# EAGLE design battery_monitor_6803-2 -no_uno (EAGLE 6.3)
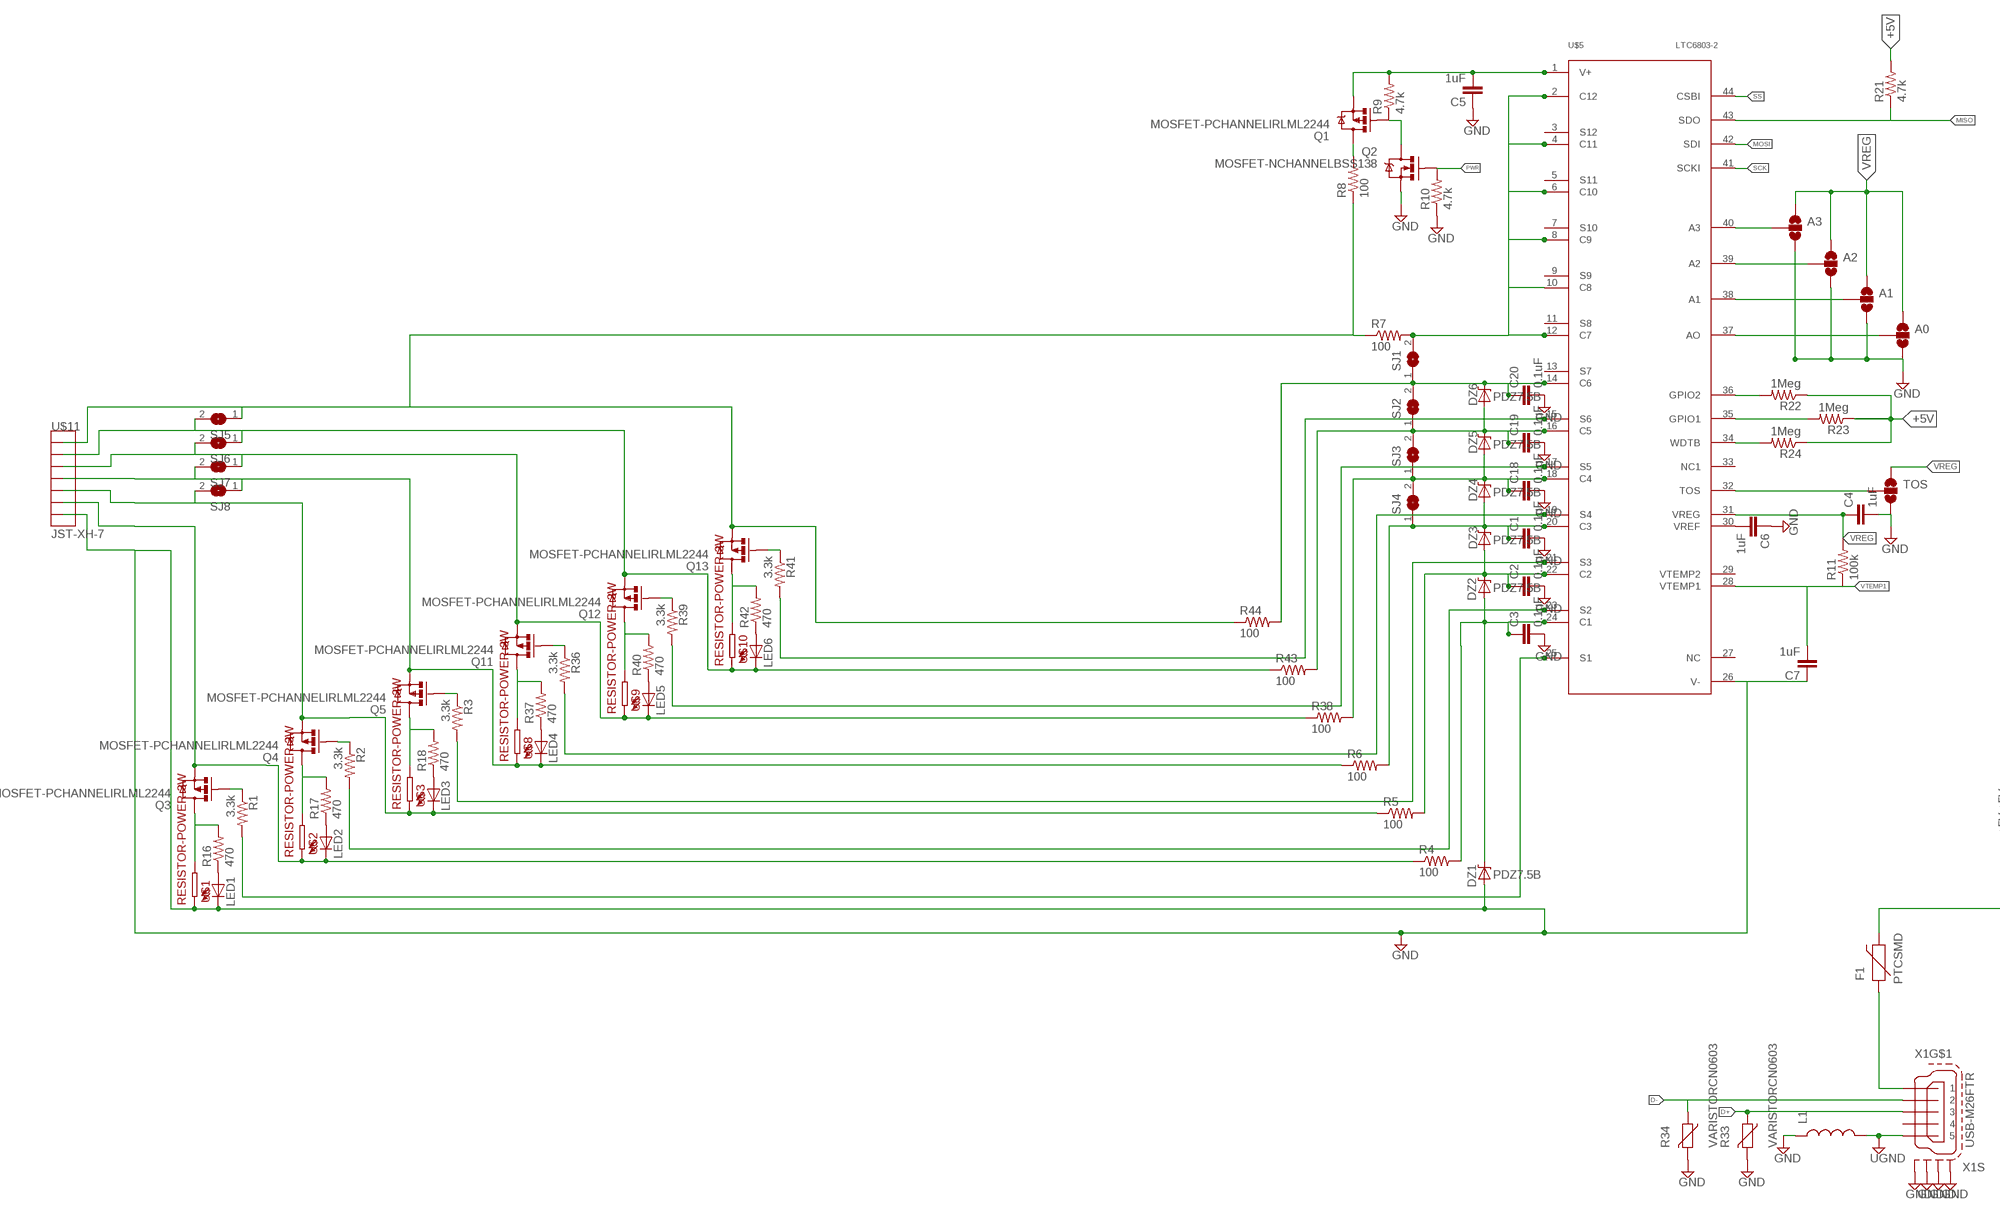
[diagram p0: schematic, sheet 1, part 1 of 2]
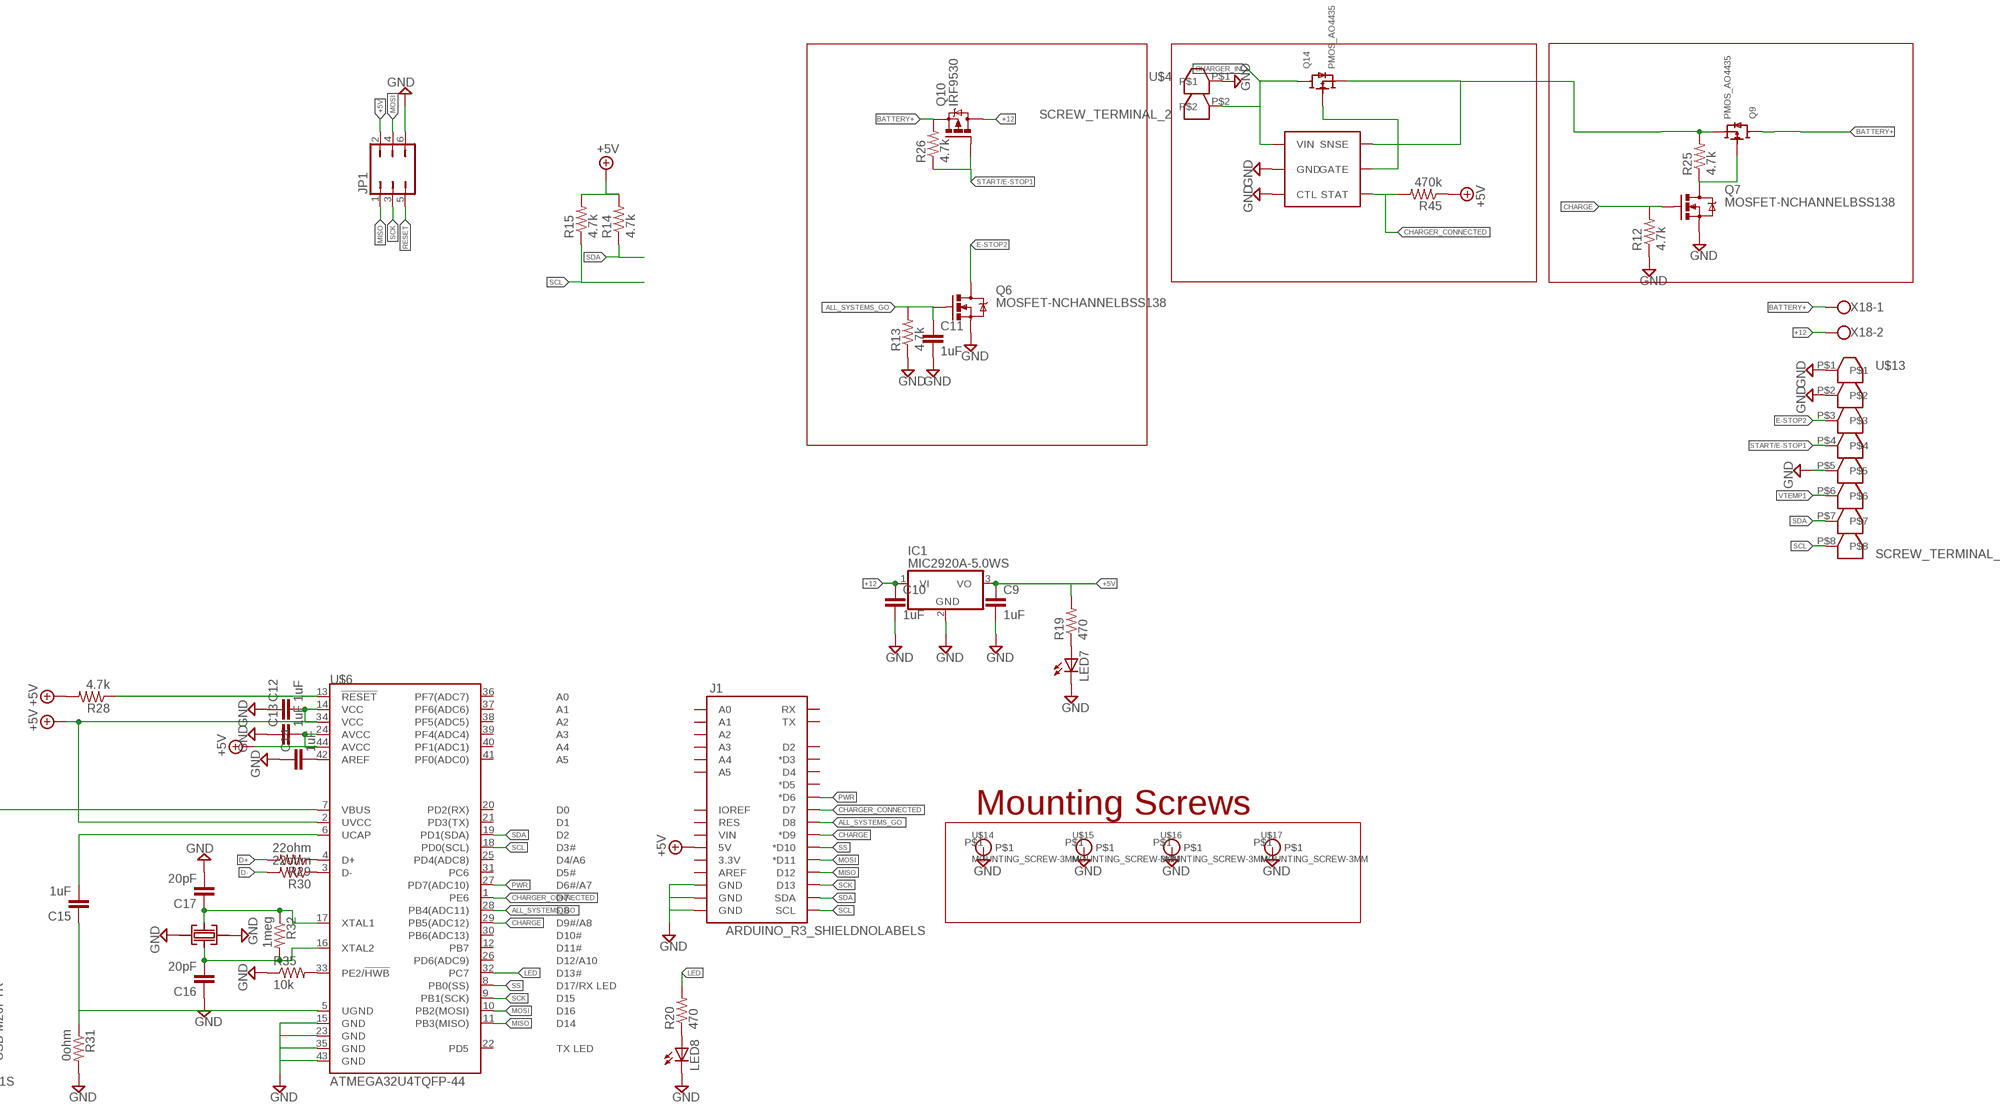
[diagram p1: schematic, sheet 1, part 2 of 2]

## Parts
A0  SOLDERJUMPER_2WAYS  [SJ_3]
A1  SOLDERJUMPER_2WAYS  [SJ_3]
A2  SOLDERJUMPER_2WAYS  [SJ_3]
A3  SOLDERJUMPER_2WAYS  [SJ_3]
C1  0.1uF  0.1UF-100V-10%(0603)  [0603-CAP]
C2  0.1uF  0.1UF-100V-10%(0603)  [0603-CAP]
C3  0.1uF  0.1UF-100V-10%(0603)  [0603-CAP]
C4  1uF  0.1UF-100V-10%(0603)  [0603-CAP]
C5  1uF  0.1UF-100V-10%(0603)  [0603-CAP]
C6  1uF  0.1UF-100V-10%(0603)  [0603-CAP]
C7  1uF  0.1UF-100V-10%(0603)  [0603-CAP]
C9  1uF  0.1UF-100V-10%(0603)  [0603-CAP]
C10  1uF  0.1UF-100V-10%(0603)  [0603-CAP]
C11  1uF  0.1UF-100V-10%(0603)  [0603-CAP]
C12  1uF  0.1UF-100V-10%(0603)  [0603-CAP]
C13  1uF  0.1UF-100V-10%(0603)  [0603-CAP]
C14  1uF  0.1UF-100V-10%(0603)  [0603-CAP]
C15  1uF  0.1UF-100V-10%(0603)  [0603-CAP]
C16  20pF  0.1UF-100V-10%(0603)  [0603-CAP]
C17  20pF  0.1UF-100V-10%(0603)  [0603-CAP]
C18  0.1uF  0.1UF-100V-10%(0603)  [0603-CAP]
C19  0.1uF  0.1UF-100V-10%(0603)  [0603-CAP]
C20  0.1uF  0.1UF-100V-10%(0603)  [0603-CAP]
DZ1  PDZ7.5B  DIODE-ZENER-BZT52  [SOD-323]
DZ2  PDZ7.5B  DIODE-ZENER-BZT52  [SOD-323]
DZ3  PDZ7.5B  DIODE-ZENER-BZT52  [SOD-323]
DZ4  PDZ7.5B  DIODE-ZENER-BZT52  [SOD-323]
DZ5  PDZ7.5B  DIODE-ZENER-BZT52  [SOD-323]
DZ6  PDZ7.5B  DIODE-ZENER-BZT52  [SOD-323]
F1  PTCSMD  [PTC-1206]
IC1  MIC2920A-5.0WS  MCP1703DB  [SOT223]
J1  ARDUINO_R3_SHIELDNOLABELS  [UNO_R3_SHIELD_NOLABELS]
JP1  JP3Q  [JP3Q]
L1  INDUCTOR0805  [0805]
LED1  LED0603  [LED-0603]
LED2  LED0603  [LED-0603]
LED3  LED0603  [LED-0603]
LED4  LED0603  [LED-0603]
LED5  LED0603  [LED-0603]
LED6  LED0603  [LED-0603]
LED7  LED0603  [LED-0603]
LED8  LED0603  [LED-0603]
Q1  MOSFET-PCHANNELIRLML2244  [SOT23-3]
Q2  MOSFET-NCHANNELBSS138  [SOT23]
Q3  MOSFET-PCHANNELIRLML2244  [SOT23-3]
Q4  MOSFET-PCHANNELIRLML2244  [SOT23-3]
Q5  MOSFET-PCHANNELIRLML2244  [SOT23-3]
Q6  MOSFET-NCHANNELBSS138  [SOT23]
Q7  MOSFET-NCHANNELBSS138  [SOT23]
Q9  PMOS_AO4435  [SOIC8]
Q10  IRF9530  [TO220BV]
Q11  MOSFET-PCHANNELIRLML2244  [SOT23-3]
Q12  MOSFET-PCHANNELIRLML2244  [SOT23-3]
Q13  MOSFET-PCHANNELIRLML2244  [SOT23-3]
Q14  PMOS_AO4435  [SOIC8]
R1  3.3k  3.3KOHM1/10W1%(0603)  [0603-RES]
R2  3.3k  3.3KOHM1/10W1%(0603)  [0603-RES]
R3  3.3k  3.3KOHM1/10W1%(0603)  [0603-RES]
R4  100  3.3KOHM1/10W1%(0603)  [0603-RES]
R5  100  3.3KOHM1/10W1%(0603)  [0603-RES]
R6  100  3.3KOHM1/10W1%(0603)  [0603-RES]
R7  100  3.3KOHM1/10W1%(0603)  [0603-RES]
R8  100  3.3KOHM1/10W1%(0603)  [0603-RES]
R9  4.7k  3.3KOHM1/10W1%(0603)  [0603-RES]
R10  4.7k  3.3KOHM1/10W1%(0603)  [0603-RES]
R11  100k  3.3KOHM1/10W1%(0603)  [0603-RES]
R12  4.7k  3.3KOHM1/10W1%(0603)  [0603-RES]
R13  4.7k  3.3KOHM1/10W1%(0603)  [0603-RES]
R14  4.7k  3.3KOHM1/10W1%(0603)  [0603-RES]
R15  4.7k  3.3KOHM1/10W1%(0603)  [0603-RES]
R16  470  3.3KOHM1/10W1%(0603)  [0603-RES]
R17  470  3.3KOHM1/10W1%(0603)  [0603-RES]
R18  470  3.3KOHM1/10W1%(0603)  [0603-RES]
R19  470  3.3KOHM1/10W1%(0603)  [0603-RES]
R20  470  3.3KOHM1/10W1%(0603)  [0603-RES]
R21  4.7k  3.3KOHM1/10W1%(0603)  [0603-RES]
R22  1Meg  3.3KOHM1/10W1%(0603)  [0603-RES]
R23  1Meg  3.3KOHM1/10W1%(0603)  [0603-RES]
R24  1Meg  3.3KOHM1/10W1%(0603)  [0603-RES]
R25  4.7k  3.3KOHM1/10W1%(0603)  [0603-RES]
R26  4.7k  3.3KOHM1/10W1%(0603)  [0603-RES]
R28  4.7k  3.3KOHM1/10W1%(0603)  [0603-RES]
R29  22ohm  3.3KOHM1/10W1%(0603)  [0603-RES]
R30  22ohm  3.3KOHM1/10W1%(0603)  [0603-RES]
R31  0ohm  3.3KOHM1/10W1%(0603)  [0603-RES]
R32  1meg  3.3KOHM1/10W1%(0603)  [0603-RES]
R33  VARISTORCN0603  [CT/CN0603]
R34  VARISTORCN0603  [CT/CN0603]
R35  10k  3.3KOHM1/10W1%(0603)  [0603-RES]
R36  3.3k  3.3KOHM1/10W1%(0603)  [0603-RES]
R37  470  3.3KOHM1/10W1%(0603)  [0603-RES]
R38  100  3.3KOHM1/10W1%(0603)  [0603-RES]
R39  3.3k  3.3KOHM1/10W1%(0603)  [0603-RES]
R40  470  3.3KOHM1/10W1%(0603)  [0603-RES]
R41  3.3k  3.3KOHM1/10W1%(0603)  [0603-RES]
R42  470  3.3KOHM1/10W1%(0603)  [0603-RES]
R43  100  3.3KOHM1/10W1%(0603)  [0603-RES]
R44  100  3.3KOHM1/10W1%(0603)  [0603-RES]
R45  470k  3.3KOHM1/10W1%(0603)  [0603-RES]
SJ1  SJ  [SJ]
SJ2  SJ  [SJ]
SJ3  SJ  [SJ]
SJ4  SJ  [SJ]
SJ5  SJ  [SJ]
SJ6  SJ  [SJ]
SJ7  SJ  [SJ]
SJ8  SJ  [SJ]
TOS  SOLDERJUMPER_2WAYS  [SJ_3]
U$1  RESISTOR-POWER-3W  [RESISTOR-3W]
U$2  RESISTOR-POWER-3W  [RESISTOR-3W]
U$3  RESISTOR-POWER-3W  [RESISTOR-3W]
U$4  SCREW_TERMINAL_2  [SCREW_TERMINAL_2]
U$5  LTC6803-2  [FSOP-44]
U$6  ATMEGA32U4TQFP-44  [TQFP44]
U$7  CRYSTAL_403  [CRYSTAL(DFN,LCC)]
U$8  RESISTOR-POWER-3W  [RESISTOR-3W]
U$9  RESISTOR-POWER-3W  [RESISTOR-3W]
U$10  RESISTOR-POWER-3W  [RESISTOR-3W]
U$11  JST-XH-7  [JST-XH-7]
U$12  LTC4412  [SOT-23-6]
U$13  SCREW_TERMINAL_8  [SCREW_TERMINAL_8]
U$14  MOUNTING_SCREW-3MM  [MOUNTING_SCREW-3MM]
U$15  MOUNTING_SCREW-3MM  [MOUNTING_SCREW-3MM]
U$16  MOUNTING_SCREW-3MM  [MOUNTING_SCREW-3MM]
U$17  MOUNTING_SCREW-3MM  [MOUNTING_SCREW-3MM]
X1  USB-M26FTR  MINI-USB-SCHIELD-32005-301  [32005-301]
X18  W237-102  [W237-102]

## Nets
+5V: C9.1 C12.2 C13.2 IC1.3(VO) J1.5V JP1.2 R14.2 R15.2 R19.2 R21.2 R22.1 R23.1 R24.1 R28.2 R45.1 U$6.2(UVCC) U$6.14(VCC) U$6.24(AVCC) U$6.34(VCC) U$6.44(AVCC)
+12: C10.1 IC1.1(VI) Q10.D X18.2
ALL_SYSTEMS_GO: C11.1 J1.D8 Q6.1(G) R13.2 U$6.28(PB4(ADC11))
BATTERY+: Q9.5(DRAIN) Q9.6(DRAIN) Q9.7(DRAIN) Q9.8(DRAIN) Q10.S R26.2 X18.1
CHARGE: J1.D9(*D9) Q7.1(G) R12.2 U$6.29(PB5(ADC12))
CHARGER_CONNECTED: J1.D7 R45.2 U$6.1(PE6) U$12.P$4(STAT)
CHARGER_IN: Q14.5(DRAIN) Q14.6(DRAIN) Q14.7(DRAIN) Q14.8(DRAIN) U$4.P$2 U$12.P$1(VIN)
D+: R29.2 R33.1 X1.3
D-: R30.2 R34.1 X1.2
E-STOP2: Q6.3(D) U$13.P$3
GND: A0.3 A1.3 A2.3 A3.3 C1.2 C2.2 C3.2 C4.2 C5.1 C6.1 C7.1 C9.2 C10.2 C11.2 C12.1 C13.1 C14.1 C16.1 C17.2 C18.2 C19.2 C20.2 DZ1.2(A) IC1.2(GND) J1.GND@0(GND) J1.GND@1(GND) J1.GND@2(GND) JP1.6 L1.1 LED1.C LED7.C LED8.C Q2.2(S) Q6.2(S) Q7.2(S) R10.1 R12.1 R13.1 R31.2 R33.2 R34.2 R35.1 TOS.3 U$1.P$2 U$4.P$1 U$5.26(V-) U$6.15(GND) U$6.23(GND) U$6.35(GND) U$6.43(GND) U$7.CASE U$7.CASE1 U$11.1 U$12.P$2(GND) U$12.P$3(CTL) U$13.P$1 U$13.P$2 U$13.P$5 U$14.P$1 U$15.P$1 U$16.P$1 U$17.P$1 X1.M1(S:S1) X1.M2(S:S2) X1.M3(S:S3) X1.M4(S:S4)
LED: R20.2 U$6.32(PC7)
MISO: J1.D12 JP1.1 R21.1 U$5.43(SDO) U$6.11(PB3(MISO))
MOSI: J1.D11(*D11) JP1.4 U$5.42(SDI) U$6.10(PB2(MOSI))
N$1: Q7.3(D) Q9.4(GATE) R25.1
N$2: LED2.C Q3.2(S) R4.1 U$2.P$2 U$11.2
N$3: LED3.C Q4.2(S) R5.1 SJ8.2 U$3.P$2 U$11.3
N$4: LED4.C Q5.2(S) R6.1 SJ7.2 SJ8.1 U$8.P$2 U$11.4
N$5: Q3.3(D) R16.2 U$1.P$1
N$6: R2.2 U$5.23(S2)
N$7: Q3.1(G) R1.1
N$8: R1.2 U$5.25(S1)
N$9: R3.2 U$5.21(S3)
N$10: Q4.3(D) R17.2 U$2.P$1
N$11: Q4.1(G) R2.1
N$12: Q5.3(D) R18.2 U$3.P$1
N$13: LED1.A R16.1
N$14: C1.1 DZ3.1(C) DZ4.2(A) R6.2 SJ4.1 U$5.20(C3)
N$15: C3.1 DZ1.1(C) DZ2.2(A) R4.2 U$5.24(C1)
N$16: C2.1 DZ2.1(C) DZ3.2(A) R5.2 U$5.22(C2)
N$17: R7.2 SJ1.2 U$5.2(C12) U$5.4(C11) U$5.6(C10) U$5.8(C9) U$5.10(C8) U$5.12(C7)
N$18: Q1.3(D) R8.2
N$19: C5.2 Q1.2(S) R9.2 U$5.1(V+)
N$20: Q1.1(G) Q2.3(D) R9.1
N$21: LED7.A R19.1
N$22: LED2.A R17.1
N$23: LED3.A R18.1
N$24: R22.2 U$5.36(GPIO2)
N$25: R23.2 U$5.35(GPIO1)
N$27: R24.2 U$5.34(WDTB)
N$28: A3.2 U$5.40(A3)
N$29: Q5.1(G) R3.1
N$30: A2.2 U$5.39(A2)
N$31: A1.2 U$5.38(A1)
N$32: A0.2 U$5.37(AO)
N$33: TOS.2 U$5.32(TOS)
N$34: C6.2 U$5.30(VREF)
N$35: LED8.A R20.1
N$36: C15.2 U$6.6(UCAP)
N$37: F1.1 X1.1
N$38: C14.2 U$6.42(AREF)
N$39: R35.2 U$6.33(PE2/!HWB)
N$40: R36.2 U$5.19(S4)
N$41: Q11.1(G) R36.1
N$42: Q11.3(D) R37.2 U$8.P$1
N$43: LED4.A R37.1
N$44: R29.1 U$6.4(D+)
N$45: R30.1 U$6.3(D-)
N$46: LED5.C Q11.2(S) R38.1 SJ6.2 SJ7.1 U$9.P$2 U$11.5
N$48: R39.2 U$5.17(S5)
N$49: Q12.1(G) R39.1
N$50: F1.2 U$6.7(VBUS)
N$51: C17.1 R32.1 U$6.17(XTAL1) U$7.IN
N$52: C16.2 R32.2 U$6.16(XTAL2) U$7.OUT
N$53: Q12.3(D) R40.2 U$9.P$1
N$54: LED5.A R40.1
N$55: C18.1 DZ4.1(C) DZ5.2(A) R38.2 SJ3.1 SJ4.2 U$5.18(C4)
N$56: LED6.C Q12.2(S) R43.1 SJ5.2 SJ6.1 U$10.P$2 U$11.6
N$58: R41.2 U$5.15(S6)
N$59: Q13.1(G) R41.1
N$60: Q9.1(SOURCE) Q9.2(SOURCE) Q9.3(SOURCE) Q14.1(SOURCE) Q14.2(SOURCE) Q14.3(SOURCE) R25.2 U$12.P$6(SNSE)
N$61: LED6.A R42.1
N$62: C19.1 DZ5.1(C) DZ6.2(A) R43.2 SJ2.1 SJ3.2 U$5.16(C5)
N$63: Q13.2(S) R7.1 R8.1 R44.1 SJ5.1 U$11.7
N$64: C20.1 DZ6.1(C) R44.2 SJ1.1 SJ2.2 U$5.14(C6)
N$67: Q14.4(GATE) U$12.P$5(GATE)
N$601: Q13.3(D) R42.2 U$10.P$1
PWR: J1.D6(*D6) Q2.1(G) R10.2 U$6.27(PD7(ADC10))
RESET: JP1.5 R28.1 U$6.13(!RESET)
SCK: J1.D13 JP1.3 U$5.41(SCKI) U$6.9(PB1(SCK))
SCL: J1.SCL R15.1 U$6.18(PD0(SCL)) U$13.P$8
SDA: J1.SDA R14.1 U$6.19(PD1(SDA)) U$13.P$7
SS: J1.D10(*D10) U$5.44(CSBI) U$6.8(PB0(SS))
START/E-STOP1: Q10.G R26.1 U$13.P$4
UGND: C15.1 L1.2 R31.1 U$6.5(UGND) X1.5
VREG: A0.1 A1.1 A2.1 A3.1 C4.1 R11.2 TOS.1 U$5.31(VREG)
VTEMP1: C7.2 R11.1 U$5.28(VTEMP1) U$13.P$6
Unconnected: J1.3.3V J1.A0 J1.A1 J1.A2 J1.A3 J1.A4 J1.A5 J1.AREF J1.D2 J1.D3(*D3) J1.D4 J1.D5(*D5) J1.IOREF J1.RES J1.RX J1.TX J1.VIN U$5.3(S12) U$5.5(S11) U$5.7(S10) U$5.9(S9) U$5.11(S8) U$5.13(S7) U$5.27(NC) U$5.29(VTEMP2) U$5.33(NC1) U$6.12(PB7) U$6.20(PD2(RX)) U$6.21(PD3(TX)) U$6.22(PD5) U$6.25(PD4(ADC8)) U$6.26(PD6(ADC9)) U$6.30(PB6(ADC13)) U$6.31(PC6) U$6.36(PF7(ADC7)) U$6.37(PF6(ADC6)) U$6.38(PF5(ADC5)) U$6.39(PF4(ADC4)) U$6.40(PF1(ADC1)) U$6.41(PF0(ADC0)) X1.4

## Notes on the sheet
- Mounting Screws

## Library data of the parts
A0 A1-A3 TOS = SparkFun:SOLDERJUMPER_2WAY: Solder Jumper 2 way solder jumper
C1-C3 C18-C20 = SparkFun-Capacitors:0.1UF-100V-10%(0603): CAP-08390; PROD_ID: CAP-08390
C4-C7 C9-C17 = SparkFun-Capacitors:0.1UF-100V-10%(0603): CAP-08390; PROD_ID: CAP-08390; VALUE: 0.1uF
DZ1-DZ6 = SparkFun-DiscreteSemi:DIODE-ZENER: Zener Diode Production Part - 8199 3.4V Zener Voltage
F1 = SparkFun-PowerIC:PTC: Resettable Fuse PTC Resettable Fuse. Spark Fun Electronics SKU : COM-08357; PROD_ID: RES-11150
IC1 = linear:MCP1703: 250 mA, 16V, Low Quiescent Current LDO Regulator Source: http://ww1.microchip.com/downloads/en/DeviceDoc/22049b.pdf
J1 = SparkFun-Boards:ARDUINO_R3_SHIELD: Shield form compatible with the Arduino Uno R3.
JP1 = jumper:JP3Q: JUMPER
L1 = SparkFun-Passives:INDUCTOR: Inductors Basic Inductor/Choke - 0603 and 1206. Footprints are not proven and vary greatly between part numbers. INDUCTOR POWER 3.3UH 4.0A SMD 0.197" L x 0.197" W x 0.177" H (5.00mm x 5.00mm x 4.50mm)
LED1-LED8 = SparkFun-LED:LED: LEDs Standard schematic elements and footprints for 5mm, 3mm, 1206, and 0603 sized LEDs. 5mm - Spark Fun Electronics SKU : COM-00529 (and others)
Q1 Q3-Q5 Q11-Q13 = SparkFun-DiscreteSemi:MOSFET-PCHANNEL: Generic PMOSFET; PROD_ID: TRANS-11153
Q2 Q6 Q7 = SparkFun-DiscreteSemi:MOSFET-NCHANNEL: Common NMOSFET Parts MFG P/N Store ID Prod ID FDD8780 TRANS-09984 SI7820DN TRANS-11055 FDS6630A IC-08089 2N7002PW TRANS-11151 FQP30N06L COM-10213 TRANS-10060 BSS123LT1G TRANS-08345 BSS138 TRANS-00830 BS170 2N7000; PROD_ID: TRANS-00830
Q9 Q14 = isaac1:PMOS_AO4435
Q10 = Adams Chips:IRF9530: P-CHANNEL HEXFET POWER-MOS-FET Source: http://www.irf.com/product-info/datasheets/data/irf9530.pdf
R1-R26 R28-R32 R35-R45 = SparkFun-Resistors:3.3KOHM1/10W1%(0603): RES-07851; PROD_ID: RES-07851
R33 R34 = varistor:VARISTOR: VARISTOR
SJ1-SJ8 = jumper:SJ: SMD solder JUMPER
U$1-U$3 U$8-U$10 = isaac1:RESISTOR-POWER-3W: PR03 series .205" dia x .657" L
U$4 = isaac1:SCREW_TERMINAL_2
U$5 = isaac1:LTC6803-2
U$6 = SparkFun-DigitalIC:ATMEGA32U4: Atmel 44-pin 8-bit Microcontroller with 32KBytes of ISP Flash and USB Controller
U$7 = isaac1:CRYSTAL_403
U$11 = isaac1:JST-XH-7
U$12 = isaac1:LTC4412
U$13 = isaac1:SCREW_TERMINAL_8
U$14-U$17 = isaac1:MOUNTING_SCREW-3MM
X1 = con-cypressindustries:MINI-USB-SCHIELD-: MINI USB-B Conector Source: www.cypressindustries.com; OC_FARNELL: unknown; OC_NEWARK: unknown
X18 = con-wago-500:W237-102: WAGO SCREW CLAMP; MPN: 237-102; OC_FARNELL: unknown; OC_NEWARK: 70K9898

## Board
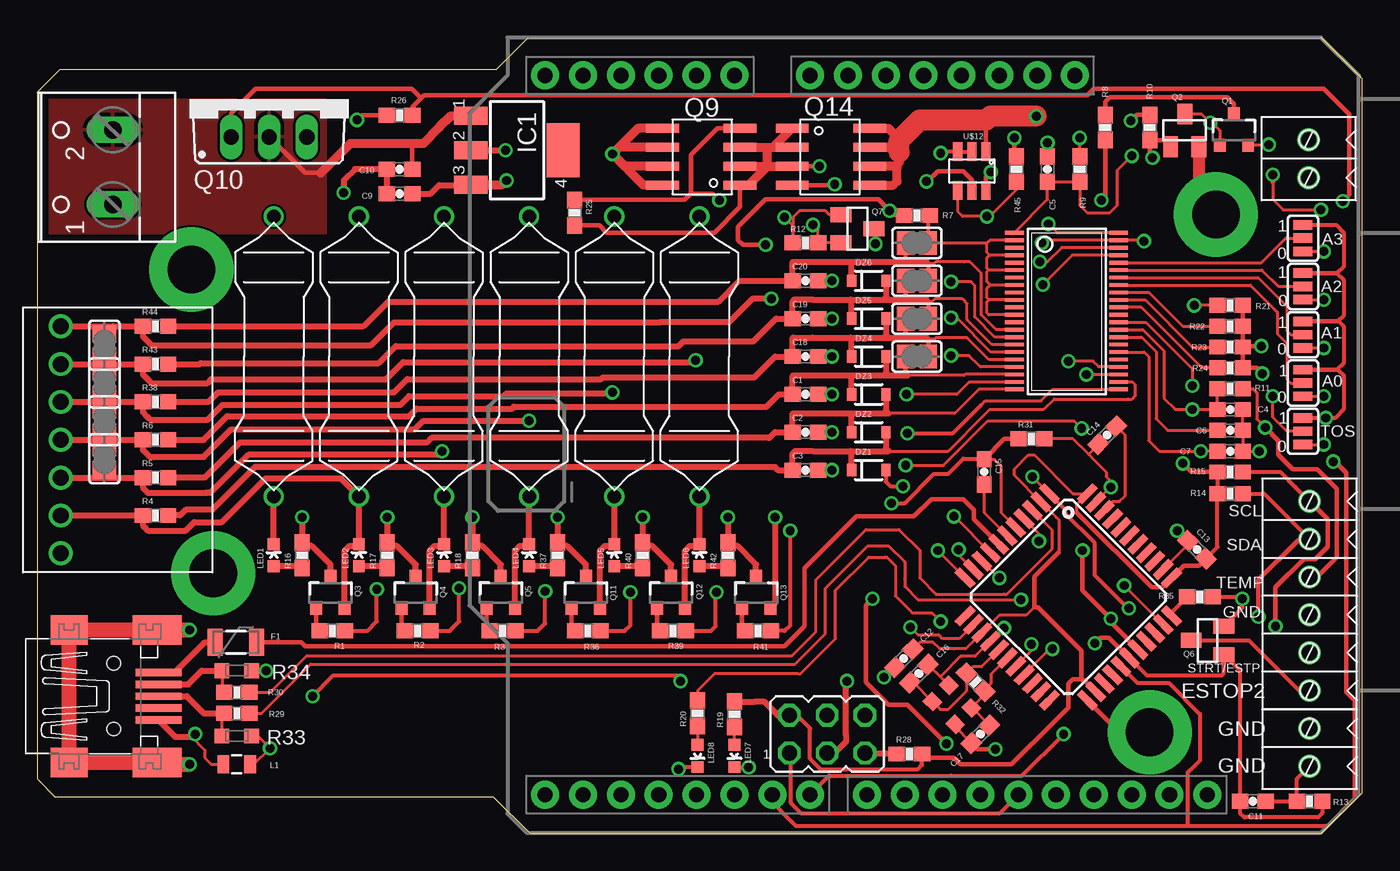
[diagram p2: board, top side]
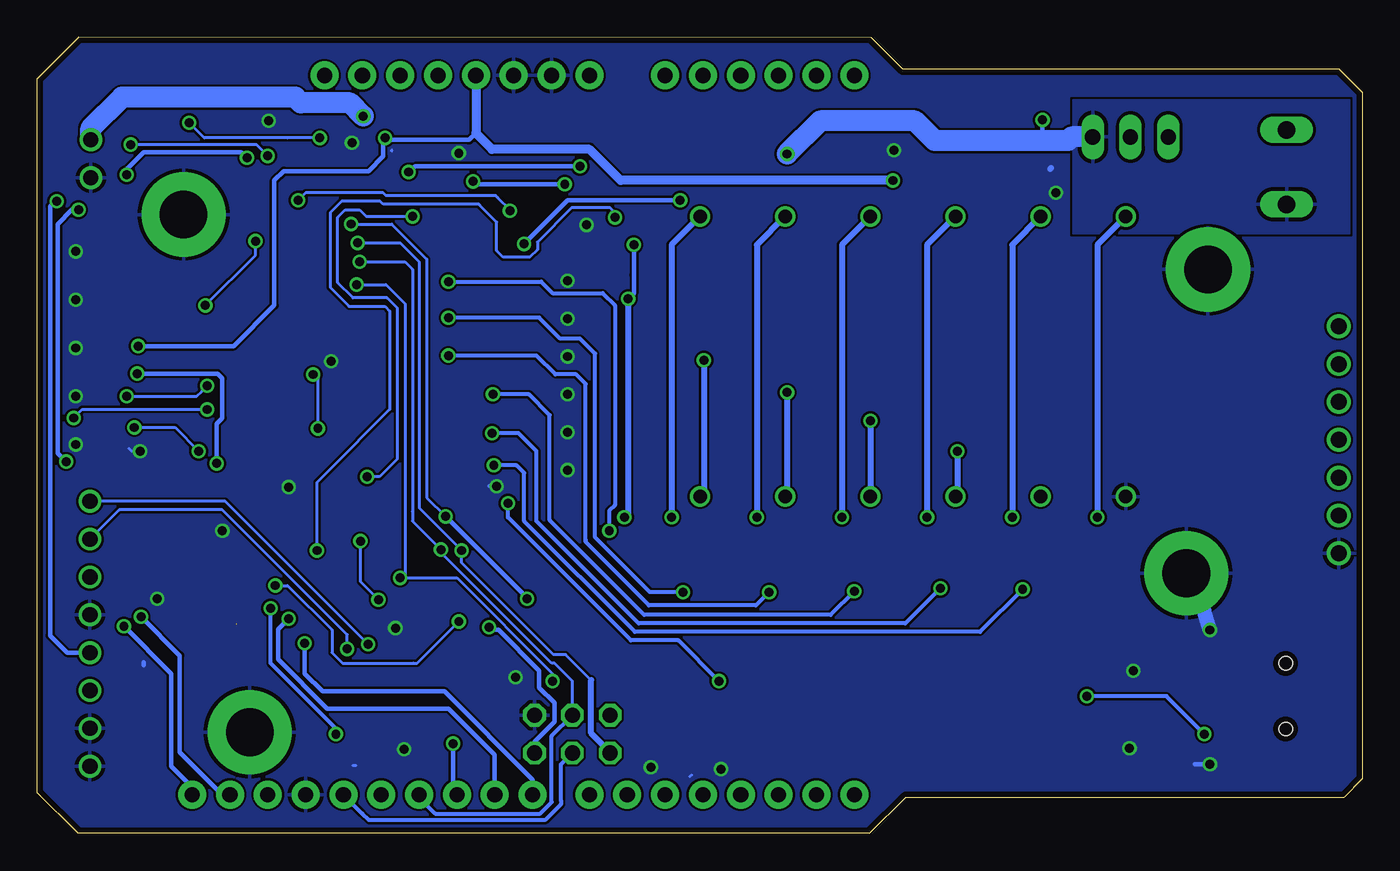
[diagram p3: board, bottom side, seen from below]

Size 88.94 x 53.43 mm. Coordinates in mm from the lower left corner, seen from the top.
Outline: 88.94,2.74 88.94,50.63
Outline: 88.94,50.63 86.15,53.43 32.95,53.4 30.82,51.27 1.56,51.3 0,49.74 0,49.73 0,3.66 1.22,2.44 30.63,2.44 33.07,0 86.2,0 86.2,0 88.94,2.74
Copper layers (1*16): Top 0.0356mm / dielectric 1.5011mm / Bottom 0.0356mm
Design rules "LaenPCBOrder *": minimum track width 6mil, minimum drill 13mil, track to track 6mil, track to pad 6mil, pad to pad 6mil, via to via 6mil, smd to smd 0mil, copper to edge 15mil, drill to drill 6mil, minimum pad ring 7mil, minimum via ring 7mil, stop-mask expansion 4mil, vias tented up to drill 25mil, thermal gap 10mil

### Footprints (pad centres in the part's own frame; a part is rotated, then mirrored left to right if it is on the bottom)
SJ_3 = smd 0.635 x 1.27: 1 -0.889,0; 2 0,0; 3 0.889,0
0603-CAP = smd 1.1 x 1: 1 -0.85,0; 2 0.85,0
SOD-323 = smd 0.63 x 0.83: 1 -1.15,0; 2 1.15,0
PTC-1206 = smd 1 x 1.8: 1 -1.4,0; 2 1.4,0
SOT223 = smd 1.219 x 2.235: 1 -2.311,-3.099; 2 0,-3.099; 3 2.311,-3.099 | smd 3.6 x 2.2: 4 0,3.099
UNO_R3_SHIELD_NOLABELS = drill 1.016 pad 1.88: 3.3V 50.8,26.67; 5V 50.8,29.21; A0 50.8,41.91; A1 50.8,44.45; A2 50.8,46.99; A3 50.8,49.53; A4 50.8,52.07; A5 50.8,54.61; AREF 2.54,15.24; D2 2.54,49.53; D3 2.54,46.99; D4 2.54,44.45; D5 2.54,41.91; D6 2.54,39.37; D7 2.54,36.83; D8 2.54,33.02; D9 2.54,30.48; D10 2.54,27.94; D11 2.54,25.4; D12 2.54,22.86; D13 2.54,20.32; GND@0 50.8,31.75; GND@1 50.8,34.29; GND@2 2.54,17.78; IOREF 50.8,21.59; NC 50.8,19.05; RES 50.8,24.13; RX 2.54,54.61; SCL 2.54,10.16; SDA 2.54,12.7; TX 2.54,52.07; VIN 50.8,36.83
JP3Q = drill 1.016 pad 1.346 octagon: 1 -2.54,-1.27; 2 -2.54,1.27; 3 0,-1.27; 4 0,1.27; 5 2.54,-1.27; 6 2.54,1.27
0805 = smd 0.8 x 1.2: 1 -0.9,0; 2 0.9,0
LED-0603 = smd 0.8 x 0.8: A 0,-0.75; C 0,0.75
SOT23-3 = smd 0.8 x 0.9: 1 -0.95,-1; 2 0.95,-1; 3 0,1.1
SOT23 = smd 1 x 1.4: 1 -0.95,-1.1; 2 0.95,-1.1; 3 0,1.1
SOIC8 = smd 0.6 x 2.2: 1 -1.905,-2.54; 2 -0.635,-2.54; 3 0.635,-2.54; 4 1.905,-2.54; 5 1.905,2.66; 6 0.635,2.66; 7 -0.635,2.66; 8 -1.905,2.66
TO220BV = drill 1.016 long: D 0,-2.54; G -2.54,-2.54; S 2.54,-2.54
0603-RES = smd 1.1 x 1: 1 -0.85,0; 2 0.85,0
CT/CN0603 = smd 1 x 1: 1 -1,0; 2 1,0
SJ = smd 1.168 x 1.6: 1 -0.762,0; 2 0.762,0
RESISTOR-3W = drill 0.9: P$1 0,9.398; P$2 0,-9.398
SCREW_TERMINAL_2 = drill 1.016 pad 1.422: P$1 0,1.27; P$2 0,-1.27
FSOP-44 = smd 0.25 x 1.25: 1 -5.25,-3.5; 2 -4.75,-3.5; 3 -4.25,-3.5; 4 -3.75,-3.5; 5 -3.25,-3.5; 6 -2.75,-3.5; 7 -2.25,-3.5; 8 -1.75,-3.5; 9 -1.25,-3.5; 10 -0.75,-3.5; 11 -0.25,-3.5; 12 0.25,-3.5; 13 0.75,-3.5; 14 1.25,-3.5; 15 1.75,-3.5; 16 2.25,-3.5; 17 2.75,-3.5; 18 3.25,-3.5; 19 3.75,-3.5; 20 4.25,-3.5; 21 4.75,-3.5; 22 5.25,-3.5; 23 5.25,3.5; 24 4.75,3.5; 25 4.25,3.5; 26 3.75,3.5; 27 3.25,3.5; 28 2.75,3.5; 29 2.25,3.5; 30 1.75,3.5; 31 1.25,3.5; 32 0.75,3.5; 33 0.25,3.5; 34 -0.25,3.5; 35 -0.75,3.5; 36 -1.25,3.5; 37 -1.75,3.5; 38 -2.25,3.5; 39 -2.75,3.5; 40 -3.25,3.5; 41 -3.75,3.5; 42 -4.25,3.5; 43 -4.75,3.5; 44 -5.25,3.5
TQFP44 = smd 1.5 x 0.5: 1 -5.8,4; 2 -5.8,3.2; 3 -5.8,2.4; 4 -5.8,1.6; 5 -5.8,0.8; 6 -5.8,0; 7 -5.8,-0.8; 8 -5.8,-1.6; 9 -5.8,-2.4; 10 -5.8,-3.2; 11 -5.8,-4; 23 5.8,-4; 24 5.8,-3.2; 25 5.8,-2.4; 26 5.8,-1.6; 27 5.8,-0.8; 28 5.8,0; 29 5.8,0.8; 30 5.8,1.6; 31 5.8,2.4; 32 5.8,3.2; 33 5.8,4 | smd 0.5 x 1.5: 12 -4,-5.8; 13 -3.2,-5.8; 14 -2.4,-5.8; 15 -1.6,-5.8; 16 -0.8,-5.8; 17 0,-5.8; 18 0.8,-5.8; 19 1.6,-5.8; 20 2.4,-5.8; 21 3.2,-5.8; 22 4,-5.8; 34 4,5.8; 35 3.2,5.8; 36 2.4,5.8; 37 1.6,5.8; 38 0.8,5.8; 39 0,5.8; 40 -0.8,5.8; 41 -1.6,5.8; 42 -2.4,5.8; 43 -3.2,5.8; 44 -4,5.8
CRYSTAL(DFN,LCC) = smd 0.991 x 0.889: CASE 1.079,-0.775; CASE1 -1.079,0.775; IN -1.079,-0.775; OUT 1.079,0.775
JST-XH-7 = drill 1.067: 1 0,-7.62; 2 0,-5.08; 3 0,-2.54; 4 0,0; 5 0,2.54; 6 0,5.08; 7 0,7.62
SOT-23-6 = smd 0.62 x 1.22: P$1 -0.95,-1.31; P$2 0,-1.31; P$3 0.95,-1.31; P$4 0.95,1.31; P$5 0,1.31; P$6 -0.95,1.31
SCREW_TERMINAL_8 = drill 1.016 pad 1.422: P$1 0,8.89; P$2 0,6.35; P$3 0,3.81; P$4 0,1.27; P$5 0,-1.27; P$6 0,-3.81; P$7 0,-6.35; P$8 0,-8.89
MOUNTING_SCREW-3MM = drill 3.2 pad 5.65: P$1 0,0
32005-301 = smd 3.1 x 0.5: 1 3,1.6; 2 3,0.8; 3 3,0; 4 3,-0.8; 5 3,-1.6 | smd 2.5 x 2: M1 -3,-4.45; M2 -3,4.45 | smd 3.3 x 2: M3 2.9,4.45; M4 2.9,-4.45 | hole 0.9: 0,2.2; 0,-2.2
W237-102 = drill 1.194 long: 1 -2.5,-1.27; 2 2.5,-1.27

### Placement (x,y rotation side)
A0  84.96,30.23 270 top
A1  84.96,33.46 270 top
A2  84.96,36.7 270 top
A3  84.96,39.94 270 top
C1  51.56,29.46 0 top
C2  51.56,26.92 0 top
C3  51.56,24.38 0 top
C4  80.07,28.45 0 top
C5  67.82,44.58 270 top
C6  80.07,27.05 180 top
C7  80.07,25.65 180 top
C9  24.32,42.93 180 top
C10  24.32,44.58 180 top
C11  81.6,2.16 0 top
C12  58.17,11.75 45 top
C13  77.85,19.05 315 top
C14  71.82,26.73 45 top
C15  63.56,24.26 270 top
C16  59.18,10.73 225 top
C17  63.31,6.67 225 top
C18  51.56,32 0 top
C19  51.56,34.54 0 top
C20  51.56,37.08 0 top
DZ1  55.82,24.38 0 top
DZ2  55.82,26.92 0 top
DZ3  55.82,29.46 0 top
DZ4  55.82,32 0 top
DZ5  55.82,34.54 0 top
DZ6  55.82,37.08 0 top
F1  13.34,12.83 0 top
IC1  32.19,45.85 270 top
J1  88.71,0.06 90 top
JP1  53.02,6.67 0 top
L1  13.4,4.64 180 top
LED1  15.88,18.67 0 top
LED2  21.59,18.67 0 top
LED3  27.3,18.67 0 top
LED4  33.02,18.67 0 top
LED5  38.73,18.67 0 top
LED6  44.45,18.67 0 top
LED7  46.8,5.21 180 top
LED8  44.32,5.21 180 top
Q1  80.33,47.18 0 top
Q2  77.03,47.18 0 top
Q3  19.68,16.13 0 top
Q4  25.4,16.13 0 top
Q5  31.11,16.13 0 top
Q6  78.55,12.95 90 top
Q7  55.05,40.58 270 top
Q9  44.64,45.4 90 top
Q10  15.56,49.28 0 top
Q11  36.83,16.13 0 top
Q12  42.55,16.13 0 top
Q13  48.26,16.13 0 top
Q14  53.21,45.4 270 top
R1  19.81,13.59 0 top
R2  25.53,13.59 0 top
R3  31.24,13.59 0 top
R4  7.94,21.34 0 top
R5  7.94,23.88 0 top
R6  7.94,26.42 0 top
R7  59.05,41.47 0 top
R8  71.69,47.37 90 top
R9  69.98,44.58 270 top
R10  74.68,47.37 270 top
R11  80.07,29.84 180 top
R12  51.56,39.62 180 top
R13  85.41,2.16 0 top
R14  80.07,22.8 180 top
R15  80.07,24.26 180 top
R16  17.78,18.67 90 top
R17  23.5,18.67 90 top
R18  29.21,18.67 90 top
R19  46.8,8 90 top
R20  44.32,8.06 90 top
R21  80.07,35.43 0 top
R22  80.07,34.04 180 top
R23  80.07,32.64 180 top
R24  80.07,31.24 180 top
R25  36.07,41.66 270 top
R26  24.32,48.2 180 top
R28  58.55,5.33 0 top
R29  13.4,8.06 180 top
R30  13.4,9.46 180 top
R31  66.74,26.48 0 top
R32  62.99,10.16 135 top
R33  13.4,6.54 0 top
R34  13.4,10.92 0 top
R35  78.04,15.88 180 top
R36  36.96,13.59 0 top
R37  34.92,18.67 90 top
R38  7.94,28.96 0 top
R39  42.67,13.59 0 top
R40  40.64,18.67 90 top
R41  48.39,13.59 0 top
R42  46.35,18.67 90 top
R43  7.94,31.5 0 top
R44  7.94,34.04 0 top
R45  65.72,44.58 270 top
SJ1  59.05,39.62 0 top
SJ2  59.05,37.08 0 top
SJ3  59.05,34.54 0 top
SJ4  59.05,32 0 top
SJ5  4.51,32.77 270 top
SJ6  4.51,30.23 270 top
SJ7  4.51,27.69 270 top
SJ8  4.51,25.15 270 top
TOS  84.96,26.99 270 top
U$1  15.88,32 0 top
U$2  21.59,32 0 top
U$3  27.3,32 0 top
U$4  85.34,45.28 180 top
U$5  69.09,35.05 270 top
U$6  69.22,15.88 315 top
U$7  61.4,8.64 135 top
U$8  33.02,32 0 top
U$9  38.73,32 0 top
U$10  44.45,32 0 top
U$11  1.59,26.42 0 top
U$12  62.74,44.45 180 top
U$13  85.41,13.4 180 top
U$14  11.81,17.46 0 top
U$15  74.68,6.79 0 top
U$16  10.35,37.85 0 top
U$17  79.12,41.53 0 top
X1  5.14,9.21 0 top
X18  3.81,44.7 90 top

### Tracks (layer width: path | path; a pad name or v marks a point on that pad's centre or on a via)
+5V  (via drill 0.6)
  Top 0.203: C12.2 59.24,12.83 60.13,12.83 60.58,12.38 61.53,12.38 62.33,12.38 U$6.14 64.61,14.67 65.34,14.67 66.42,14.67 66.93,15.18 | C13.2 | 69.79,21.53 69.79,22.1 U$6.44 69.52,22.8 66.93,25.4 66.55,25.4 65.6,24.45 65.6,24.02 U$6.2 68.41,21.21 68.58,21.04 68.58,18.86 | 70.28,10.29 70.17,10.29 | R23.1 80.99,32.7
  Top 0.254: R15.2 R14.2 79.22,19.22 C13.2 | 59.37,5.31 R28.2 59.4,4.6 59.12,4.32 52.58,4.32 51.88,5.02 51.88,7.05 50.99,7.94 JP1.2
  Top 0.305: C13.2 77.98,17.97 76.97,17.97 U$6.34 75.51,16.51 74.8,16.51 69.79,21.53 | U$6.24 70.28,10.29 | 68.58,18.86 66.93,17.21 66.93,15.18 67.18,15.18 70.1,12.26 70.1,10.35 | 70.1,10.35 70.17,10.29 | v65.6,46.67 65.6,45.55 R45.1 | R21.2 R22.1 R23.1 R24.1 81.85,31.24 v82.23,30.86 | 80.99,32.7 v82.17,32.7 | 29.06,43.5 IC1.3 | 70.1,10.35 69.53,10.35 69.22,10.03 69.22,8.45 68.26,7.49 65.41,4.64 62.99,4.64 61.98,4.64 61.53,5.08 59.65,5.08 R28.2 | R15.2 77.47,24.26 v76.9,24.83
  Top 0.406: IC1.3 29.06,43.5 26.99,43.5 26.42,42.93 C9.1 | R19.2 46.82,8.83 48.13,8.83 48.83,8.83 49.66,8 49.66,7.94 JP1.2
  Top 0.61: IC1.3 31.22,43.54 v31.5,43.81
  Bottom 0.203: 65.72,46.55 v65.6,46.67
  Bottom 0.305: v65.6,46.67 65.47,46.55 60.01,46.55 59.94,46.55 59.5,46.99 | 65.72,46.55 R45.1 66.7,44.45 72.39,44.45 73.03,43.81 73.03,35.43 75.75,32.7 v82.17,32.7 | v76.9,24.83 76.9,27.5 76.52,27.88 76.52,30.54 76.83,30.86 v82.23,30.86
  Bottom 0.61: v31.5,43.81 49.78,43.81 51.88,45.91 58.42,45.91 59.5,46.99 J1.5V
+12
  Top 0.305: 29.07,48.13 IC1.1 | 19.05,44.32 17.97,44.32 Q10.D | C10.1 25.17,46.19 25.27,46.29
  Top 0.61: 29.07,48.13 27.75,48.13 26.99,47.37 25.91,46.29 25.27,46.29 21.02,46.29 19.05,44.32
  pour Top: 0.83,40.32 19.37,40.32 19.37,49.21 0.83,49.21
ALL_SYSTEMS_GO  (via drill 0.6)
  Top 0.254: R13.2 86.26,1.36 85.98,1.08 81.03,1.08 80.77,1.33 80.77,2.13 C11.1 80.75,10.91 Q6.1 79.65,10.75 79.5,10.6 74.48,10.6 U$6.28
  Top 0.305: v70.99,12.76 71.37,13.14 71.82,13.14 71.94,13.14 U$6.28
  Bottom 0.305: v70.99,12.76 70.99,10.73 69.79,9.53 62.61,9.53 61.59,9.53 55.69,3.62 J1.D8
BATTERY+  (via drill 0.6)
  Top 0.305: R26.2 22.61,48.2 21.78,48.2 v21.46,47.88
  Top 0.61: Q9.5 40.32,47.31 v38.61,45.59 | Q9.6 39.05,46.04 v38.61,45.59 | Q9.7 39.43,44.77 v38.61,45.59 | Q9.8 40.7,43.5 v38.61,45.59
  Bottom 0.203: Q10.S 19.62,46.74 | 20.89,46.48 20.7,46.48
  Bottom 0.305: 21.46,46.99 v21.46,47.88 21.46,46.99 | 21.46,46.99 21.46,46.48
  Bottom 1.422: Q10.S 19.49,46.74 19.75,46.48 20.7,46.48 20.89,46.48 21.46,46.48 22.35,46.48 28.7,46.48 30.04,47.82 36.39,47.82 v38.61,45.59
  pour Bottom (isolate 0.203): 0.89,40.26 19.37,40.26 19.37,49.21 0.89,49.21
CHARGE  (via drill 0.6)
  Top 0.203: Q7.1 53.15,41.53 52.9,41.78 51.18,41.78 50.74,41.34 50.74,39.75 | 50.74,39.75 50.74,39.65 R12.2 | 50.74,39.75 50.74,40.77 v50.16,41.34 | U$6.29 73.88,12.35
  Top 0.305: U$6.29 72.33,13.89 72.07,14.15 v72.07,14.41 70.17,16.32 70.17,16.7 v70.17,18.99
  Bottom 0.203: v50.16,41.34 50.16,41.66 50.48,41.97 53.09,41.97 55.37,39.69 55.37,39.18 55.88,38.67 57.66,38.67 58.1,39.12 58.1,41.02 59.24,42.16 59.31,42.23 65.72,42.23 65.91,42.42 68.52,42.42 69.28,41.66 69.28,36.64 68.01,35.37 65.6,35.37 65.28,35.05 65.28,28.45 69.53,24.19 70.17,23.56 v70.17,18.99
  Bottom 0.305: J1.D9 58.23,5.27 61.34,8.38 69.47,8.38 72.77,11.68 72.77,13.72 v72.07,14.41
CHARGER_CONNECTED  (via drill 0.6)
  Top 0.203: U$6.1 v66.8,23.94 | R45.2 65.72,43.18 63.94,41.4 v63.75,41.4 62.1,41.4 61.78,41.72 U$12.P$4 | U$12.P$4
  Top 0.254: J1.D7 53.15,3.87 61.34,3.87 66.1,3.87 v68.9,6.67 | v73.28,15.11 73.22,15.11 70.99,17.34 70.99,19.49 69.03,21.46 69.03,21.72 U$6.1
  Bottom 0.203: v63.75,41.4 66.86,41.4 67.31,41.85 68.26,41.85 68.77,41.34 68.77,36.96 67.75,35.94 65.47,35.94 64.77,35.24 64.77,25.15 65.98,23.94 v66.8,23.94
  Bottom 0.254: v68.9,6.67 68.9,7.05 73.28,11.43 v73.28,15.11
CHARGER_IN  (via drill 0.6)
  Top 0.305: 57.47,43.5 57.72,43.75 | 57.72,46.74 57.72,43.88 57.78,43.81 | U$12.P$1 63.69,47.88
  Top 0.61: Q14.8 57.15,47.31 57.72,46.74 57.72,46.23 57.53,46.04 | 57.53,46.04 Q14.7 57.53,46.04 | 57.53,46.04 57.85,45.72 57.85,45.02 57.59,44.77 | 57.59,44.77 Q14.6 | Q14.5 57.47,43.5 | 57.72,43.75 57.72,44.64 57.59,44.77
  Top 1.422: 57.85,45.72 57.85,46.48 59.24,47.88 63.69,47.88 64.01,48.13 v67.06,48.13
  Bottom 1.422: U$4.P$2 85.34,47.31 83.25,49.4 72.52,49.4 71.63,49.4 71.25,49.02 67.94,49.02 v67.06,48.13
D+
  Top 0.203: R33.1 12.4,7.92 R29.2
  Top 0.406: X1.3 10.03,9.21 11.18,8.06 R29.2
D-
  Top 0.203: R34.1 12.4,9.61 R30.2
  Top 0.406: X1.2 10.13,10.01 11.05,10.92 R34.1
E-STOP2
  Top 0.254: Q6.3 81.34,12.95 84.71,9.59 U$13.P$3
GND  (via drill 0.6)
  Top 0.203: U$5.26 71.25,31.3 70.87,31.69 v69.22,31.69 | C4.2 C6.1 C7.1 v82.04,25.65 | A3.3 v86.36,39.05 | A2.3 v86.36,35.81 | A1.3 v86.36,32.58 | A0.3 v86.36,29.34 | TOS.3 v86.36,26.1 | U$7.CASE 60.62,10.52 | 60.62,10.52 59.8,11.33 C16.1 | 60.62,10.52 61.98,11.87 62.95,11.87 U$6.15 64.86,13.78 v64.9,13.78 | C17.2 61.62,7.16 U$7.CASE1 | C12.1 57.5,11.15 v56.83,10.48 | U$6.35 77.25,19.38 C13.1 76.58,20.32 v76.52,20.32 | U$6.43 71.86,23.05 v72.07,23.24 72.07,23.62 71.75,23.94 71.75,24.25 70.99,25.02 70.58,25.43 | R34.2 v15.37,10.92 | R33.2 14.8,6.54 v15.62,5.71 14.54,4.64 L1.1 | Q7.2 R12.1 52.41,40.49 v52.07,40.83 | C5.1 v67.82,46.35 | 70.58,25.43 69.53,26.48 R31.2 | C14.1 71.22,26.07 70.58,25.43
  Top 0.254: DZ1.2 56.97,23.61 57.28,23.3 v58.1,23.3 | U$12.P$2 U$12.P$3 60.75,45.76 v60.64,45.66 | LED8.C 43.19,4.46 v43.05,4.32 | LED7.C v47.74,4.46 v47.75,4.45 | C11.2 R13.1 84.56,3.66 U$13.P$1 | R35.1 80.77,15.88 v80.9,15.75 80.9,15.15 Q6.2
  Top 0.305: X1.M4 8.16,4.64 | R10.1 73.81,48.22 v73.41,47.82 | U$6.23 72.64,6.79 73.28,6.79 U$15.P$1 | C17.2 63.12,5.65 v64.33,5.65
  Top 0.406: LED1.C U$1.P$2 | C20.2 v53.34,37.08 | C19.2 v53.34,34.54 | C18.2 v53.34,32 | C1.2 v53.34,29.46 | C2.2 v53.34,26.92 | C3.2 v53.34,24.38 | IC1.2 v31.43,45.85 | C9.2 C10.2 21.34,44.58 20.57,43.81 v20.57,42.99
  Top 0.813: Q2.2 77.97,42.67 U$17.P$1
  Top 1.016: X1.M4 X1.M1 X1.M2 X1.M3 8.96,13.66 v10.22,13.65 | 8.16,4.64 v10.22,4.64
  Bottom 0.203: v69.22,31.69 69.22,31.62 | v82.04,25.65 82.61,25.65 82.8,25.84 | v86.36,39.05 86.55,39.05 | v86.36,35.81 86.42,35.81 | v86.36,32.58 86.36,32.83 | v86.36,29.34 86.36,29.59 | v86.36,26.1 86.36,26.23 | v64.9,13.78 64.96,13.84 | v56.83,10.48 56.83,10.41 | v72.07,23.24 72.14,23.3 | v76.52,20.32 76.45,20.32 | v15.37,10.92 15.49,10.92 | v15.62,5.71 15.81,5.71 | 67.75,4.57 67.56,4.57 | 65.15,45.78 65.15,45.85 | v52.07,40.83 52.01,40.89 | v67.82,46.35 67.82,46.55 | 45.15,3.81 45.02,3.94
  Bottom 0.254: v58.1,23.3 58.61,23.3 | v60.64,45.66 60.58,45.66 | v43.05,4.32 42.99,4.32 | v47.75,4.45 47.82,4.45
  Bottom 0.305: v10.22,4.64 11.24,4.64 | 81.79,11.3 81.79,11.49 | v73.41,47.82 73.34,47.82 | v64.33,5.65 64.39,5.71 64.45,5.71
  Bottom 0.406: v53.34,37.08 53.66,37.08 | v53.34,34.54 53.47,34.54 | v53.34,32 53.4,32.07 | v53.34,29.46 53.53,29.46 53.59,29.4 | v53.34,26.92 53.4,26.92 | v53.34,24.38 53.4,24.45 | v31.43,45.85 31.43,45.91 | 20.89,44.64 20.95,44.58
  Bottom 1.016: v10.22,13.65 10.6,14.92
  pour Bottom (rank 2): -1.46,-2.1 165.1,-2.54 165.1,104.14 -1.27,104.14
LED  (via drill 0.6)  (1 unrouted)
  Top 0.203: 75.56,14.04 v72.96,16.64 | R20.2 44.32,9.59 45.47,10.73 51.05,10.73 51.24,10.73 53.59,13.08 53.59,16.32 55.82,18.54 56.9,18.54 57.02,18.54 57.59,17.97 57.59,15.94 58.74,14.8 60.07,14.8 v60.64,14.22
  Bottom 0.203: v72.96,16.64 72.14,16.64 69.15,13.65 69.15,12.13 68.45,11.43 63.69,11.43 63.44,11.43 v60.64,14.22
MISO  (via drill 0.6)
  Top 0.203: v67.44,39.62 67.61,39.8 U$5.43 74.24,39.8 v74.3,39.75 | v60.45,18.99 v60.45,18.98 U$6.11 | R21.1 v77.66,35.43
  Top 0.254: J1.D12 64.58,1.33 51.75,1.33 51.31,1.33 50.61,2.03 50.61,5.27 JP1.1
  Bottom 0.203: v67.44,39.62 64.58,39.62 63.31,38.35 63.31,21.84 v60.45,18.99 60.45,18.16 54.29,12 53.47,12 51.75,10.29 | JP1.1 50.48,5.46 | v77.66,35.43 74.3,38.8 v74.3,39.75
  Bottom 0.406: 50.48,5.46 51.75,6.73 51.75,10.29
MOSI  (via drill 0.6)
  Top 0.203: U$5.42 68.77,39.3 67.82,38.35 v67.31,38.35 | v61.85,19.05 61.85,18.72 U$6.10
  Bottom 0.203: v67.31,38.35 64.26,38.35 63.75,37.85 63.75,21.59 63.75,20.95 v61.85,19.05 61.85,18.86 61.47,18.48 54.42,11.43 54.23,11.43 53.02,10.22 JP1.4
  Bottom 0.254: JP1.4 54.42,6.54 54.42,2.1 55.18,1.33 62.23,1.33 63.31,2.41 J1.D11
N$1  (via drill 0.6)
  Top 0.305: R25.1 43.46,42.51 43.88,42.93 | 43.88,42.93 43.88,45.53 45.66,47.31 Q9.4 | 43.88,42.93 45.34,42.93 v45.78,42.48 | v56.26,39.56 56.26,40.47 Q7.3
  Bottom 0.305: v45.78,42.48 53.34,42.48 v56.26,39.56
N$2
  Top 0.406: Q3.2 20.64,18.98 20.95,19.3 21.48,19.3 LED2.C U$2.P$2 20.38,23.81 15.3,23.81 12.38,20.89 10.54,20.89 9.97,20.32 7.43,20.32 7.18,20.57 7.09,20.66 R4.1 U$11.2
N$3  (via drill 0.6)
  Top 0.305: SJ8.2 4.57,24.38 5.08,23.88
  Top 0.406: Q4.2 26.35,18.98 26.67,19.3 27.19,19.3 LED3.C U$3.P$2 | U$11.3 5.08,23.88 R5.1 7.09,23.2 7.43,22.86 11.3,22.86 | 11.3,22.86 11.43,22.86 | 11.3,22.86 11.62,22.86 14.16,25.4 26.92,25.4 v27.18,25.65
  Bottom 0.406: v27.18,25.65 27.18,22.73 U$3.P$2
N$4  (via drill 0.6)
  Top 0.305: SJ7.2 4.57,26.92 5.08,26.42 4.57,25.91 SJ8.1
  Top 0.406: Q5.2 32.06,18.98 32.38,19.3 32.91,19.3 LED4.C U$8.P$2 | U$11.4 5.08,26.42 R6.1 7.09,25.74 7.43,25.4 7.56,25.27 11.18,25.27 13.02,27.11 25.34,27.11 25.91,27.69 v33.02,27.69
  Bottom 0.406: v33.02,27.69 U$8.P$2
N$5  (via drill 0.6)
  Top 0.406: v17.78,21.21 R16.2 18,19.3 18.41,19.3 19.68,18.03 Q3.3
  Bottom 0.406: U$1.P$1 17.78,39.5 v17.78,21.21
N$6  (via drill 0.6)
  Top 0.203: 63.37,28.77 63.63,29.02 67.37,29.02 68.16,29.8 U$5.23
  Top 0.254: R2.2 27.69,13.59 28.32,14.22 v28.32,16.45 | v58.42,26.86 61.47,26.86 63.37,28.77
  Bottom 0.254: v28.32,16.45 30.67,14.1 48.58,14.1 55.44,20.95 55.44,25.65 56.64,26.86 v58.42,26.86
N$7
  Top 0.305: Q3.1 18.73,13.82 R1.1
N$8  (via drill 0.6)
  Top 0.203: v58.29,24.7 60.83,24.7 63.82,27.69 69.6,27.69 v70.1,27.18 | v70.42,30.8 U$5.25
  Top 0.254: R1.2 22.16,13.59 22.8,14.22 v22.8,16.38
  Bottom 0.203: v70.1,27.18 70.1,30.48 v70.42,30.8
  Bottom 0.254: v22.8,16.38 25.65,13.53 48.83,13.53 56.26,20.95 56.26,24.19 56.77,24.7 v58.29,24.7
N$9  (via drill 0.6)
  Top 0.203: U$5.21 65.58,30.29 62.55,30.29 61.72,29.46 v58.36,29.46
  Top 0.254: R3.2 33.59,13.59 34.1,14.1 v34.1,16.26
  Bottom 0.254: v58.36,29.46 55.94,29.46 54.55,28.07 54.55,21.02 48.2,14.67 35.69,14.67 v34.1,16.26
N$10  (via drill 0.6)
  Top 0.406: v23.5,21.21 R17.2 23.71,19.3 24.13,19.3 25.4,18.03 Q4.3
  Bottom 0.406: U$2.P$1 23.5,39.5 v23.5,21.21
N$11
  Top 0.305: Q4.1 24.45,13.82 R2.1
N$12  (via drill 0.6)
  Top 0.406: v29.21,21.21 R18.2 29.43,19.3 29.84,19.3 31.11,18.03 Q5.3
  Bottom 0.406: U$3.P$1 29.21,39.5 v29.21,21.21
N$13
  Top 0.406: R16.1 17.68,17.92 LED1.A
N$14
  Top 0.203: U$5.20 62.3,30.8 62.23,30.73 58.42,30.73
  Top 0.305: SJ4.1 58.29,30.86 58.42,30.73
  Top 0.406: 54.61,30.73 52.07,30.73 50.74,30.73 50.71,30.71 C1.1 49.78,29.46 48.96,28.64 32,28.64 31.88,28.51 25.46,28.51 24.96,28 12.76,28 11.18,26.42 R6.2 | 54.61,30.73 57.15,30.73 | 57.15,30.73 58.42,30.73 | DZ3.1 54.67,30.68 54.61,30.73 | DZ4.2 56.97,30.92 57.15,30.73
N$15
  Top 0.203: 57.15,25.65 61.15,25.65 63.63,28.13 63.94,28.45 67.56,28.45 68.26,29.15 73.22,29.15 73.47,29.15 73.72,29.4 73.72,30.1 73.52,30.3 U$5.24
  Top 0.406: 54.61,25.65 52.07,25.65 50.88,25.65 50.71,25.49 C3.1 49.72,24.38 49.53,24.57 49.47,24.57 14.61,24.57 11.75,21.72 9.97,21.72 9.59,21.34 R4.2 | 54.61,25.65 57.15,25.65 56.97,25.84 DZ2.2 | DZ1.1 54.67,25.6 54.61,25.65
N$16
  Top 0.203: U$5.22 63.2,29.8 61.59,28.19 57.15,28.19
  Top 0.406: 54.61,28.19 52.07,28.19 50.74,28.19 50.71,28.17 C2.1 49.53,26.92 49.15,26.54 49.09,26.54 26.48,26.54 26.16,26.23 13.59,26.23 11.24,23.88 R5.2 | 54.61,28.19 57.15,28.19 56.97,28.38 DZ3.2 | DZ2.1 54.67,28.14 54.61,28.19
N$17
  Top 0.203: U$5.2 63.93,39.8 63.75,39.62 | U$5.4 63.94,38.8 | 63.94,38.8 63.75,38.99 63.75,39.62 | U$5.6 63.86,37.8 | 63.86,37.8 63.75,37.91 63.75,38.62 63.94,38.8 | U$5.8 63.97,36.8 | 63.97,36.8 63.82,36.96 63.75,37.02 63.75,37.69 63.86,37.8 | U$5.10 63.89,35.8 | 63.89,35.8 63.75,35.94 63.75,36.58 63.97,36.8 | U$5.12 63.88,34.8 63.75,34.92 63.75,35.66 63.89,35.8 | SJ1.2 63.75,39.62
  Top 0.254: SJ1.2 59.82,41.38 R7.2
N$18
  Top 0.305: Q1.3 80.33,48.96 79.88,49.4 72.83,49.4 72.01,49.4 71.69,49.09 R8.2
N$19  (via drill 0.6)
  Top 0.203: U$5.1 65.59,40.31 67.82,42.55 C5.2 R9.2 69.98,42.55 69.98,42.16 70.48,41.66 72.01,41.66 72.52,42.16 72.52,44.51 v73.47,45.47 | v82.68,46.23 82.63,46.18 Q1.2
  Bottom 0.203: v73.47,45.47 74.23,46.23 v82.68,46.23
N$20  (via drill 0.6)
  Top 0.203: R9.1 69.98,45.91 v69.98,46.67 | Q1.1 79.38,47.18 78.87,47.69 v78.74,47.69 78.15,48.28 Q2.3
  Bottom 0.203: v69.98,46.67 72.14,46.67 77.72,46.67 v78.74,47.69
N$21
  Top 0.203: LED7.A R19.1
N$22
  Top 0.406: R17.1 23.39,17.92 LED2.A
N$23
  Top 0.406: R18.1 29.11,17.92 LED3.A
N$24
  Top 0.203: U$5.36 74.63,36.3 76.9,34.04 R22.2
N$25
  Top 0.203: U$5.35 74.37,35.8 77.53,32.64 R23.2
N$27
  Top 0.203: R24.2 78.17,31.24 74.11,35.31 U$5.34
N$28
  Top 0.203: U$5.40 82.18,38.3 83.82,39.94 A3.2
N$29
  Top 0.305: Q5.1 30.16,13.82 R3.1
N$30
  Top 0.203: U$5.39 82.21,37.8 83.31,36.7 A2.2
N$31
  Top 0.203: U$5.38 81.95,37.3 83.88,35.37 83.88,33.72 84.14,33.47 A1.2
N$32
  Top 0.203: U$5.37 81.44,36.8 83.25,34.99 83.25,33.53 83.88,32.89 83.88,30.48 84.14,30.23 A0.2
N$33  (via drill 0.6)
  Top 0.203: TOS.2 83.88,26.99 82.93,27.94 v82.93,29.34 | U$5.32 74.41,34.3 77.53,31.18 v77.53,30.04
  Bottom 0.203: v82.93,29.34 78.23,29.34 77.88,29.69 v77.53,30.04
N$34
  Top 0.203: 79.06,26.95 C6.2 78.36,27.05 75.88,27.05 75.12,27.81 75.12,32.32 74.14,33.3 U$5.30
N$35
  Top 0.203: R20.1 LED8.A
N$36
  Top 0.203: U$6.6 63.56,21.53 C15.2
N$37
  Top 0.305: X1.1 9.22,10.81
  Top 0.406: 9.22,10.81 11.24,12.83 F1.1
N$38
  Top 0.203: U$6.42 71.62,21.71 72.2,22.29 72.64,22.29 73.03,22.67 73.03,26.73 C14.2
N$39
  Top 0.254: U$6.33 76.14,14.83 R35.2
N$40  (via drill 0.6)
  Top 0.203: U$5.19 63.31,31.3 62.55,32.07 v61.34,32.07
  Top 0.254: R36.2 39.43,13.59 39.81,13.97 v39.81,16.19
  Bottom 0.254: v61.34,32.07 55.44,32.07 54.17,30.8 52.77,30.8 52.13,30.16 52.13,19.68 52.13,19.56 47.88,15.3 40.7,15.3 v39.81,16.19
N$41
  Top 0.305: Q11.1 35.88,13.82 R36.1
N$42  (via drill 0.6)
  Top 0.406: v34.92,21.21 R37.2 35.14,19.3 35.56,19.3 36.83,18.03 Q11.3
  Bottom 0.406: U$8.P$1 34.92,39.5 v34.92,21.21
N$43
  Top 0.406: R37.1 34.83,17.92 LED4.A
N$44  (via drill 0.6)
  Top 0.203: R29.1 15.05,8.06 18.35,11.37 50.86,11.37 52.9,13.4 52.9,16.45 55.75,19.3 57.15,19.3 58.23,18.22 58.23,17.08 58.23,16.57 59.12,15.68 v66.04,15.68 | v67.25,19.62 67.25,20.11 U$6.4
  Bottom 0.203: v66.04,15.68 67.25,16.89 v67.25,19.62
N$45
  Top 0.203: R30.1 15.62,9.46 18.1,11.94 50.67,11.94 52.26,13.53 52.26,17.02 55.63,20.38 57.85,20.38 59.24,18.99 59.24,17.14 60.33,16.07 64.9,16.07 65.09,16.07 68.14,19.11 68.14,20.35 U$6.3
N$46  (via drill 0.6)
  Top 0.305: SJ6.2 4.57,29.46 5.08,28.96 4.57,28.45 SJ7.1
  Top 0.406: Q11.2 37.78,18.98 38.1,19.3 38.62,19.3 LED5.C U$9.P$2 | U$11.5 5.08,28.96 R38.1 7.09,28.28 7.43,27.94 7.62,27.75 11.43,27.75 12.38,28.7 12.45,28.77 24.38,28.77 24.96,29.34 31.3,29.34 31.5,29.53 38.54,29.53 v38.61,29.59
  Bottom 0.406: v38.61,29.59 38.61,22.73 U$9.P$2
N$48  (via drill 0.6)
  Top 0.203: U$5.17 64.03,32.3 61.72,34.61 61.59,34.61 v61.34,34.61
  Top 0.254: R39.2 45.21,13.59 45.53,13.91 45.53,16.13 v45.59,16.19
  Bottom 0.254: v61.34,34.61 55.24,34.61 53.85,33.21 52.51,33.21 51.5,32.19 51.5,19.88 47.82,16.19 v45.59,16.19
N$49
  Top 0.305: Q12.1 41.59,13.82 R39.1
N$50
  Top 0.305: F1.2 17.72,12.83 17.97,12.57 50.16,12.57 51.5,13.91 51.5,17.78 54.99,21.27 58.86,21.27 60.01,22.42 62.17,22.42 62.87,21.72 62.87,21.08 64.54,19.41 U$6.7
N$51
  Top 0.203: U$6.17 64.01,10.67 64.01,10.03 63.59,9.62 R32.1 63.59,9.3 U$7.IN 62.76,8.42 C17.1
N$52
  Top 0.203: U$6.16 63.38,11.18 62.8,11.18 R32.2 62.39,9.56 61.15,8.32 60.63,8.32 U$7.OUT 58.81,10.13 C16.2
N$53  (via drill 0.6)
  Top 0.406: v40.64,21.21 R40.2 40.85,19.3 41.27,19.3 42.55,18.03 Q12.3
  Bottom 0.406: U$9.P$1 40.64,39.5 v40.64,21.21
N$54
  Top 0.406: R40.1 40.54,17.92 LED5.A
N$55
  Top 0.203: U$5.18 63.89,31.8 62.42,33.27 62.23,33.27 60.33,33.27 60.2,33.15 59.82,33.15
  Top 0.305: SJ3.1 58.29,33.4 58.42,33.27 | SJ4.2 59.82,33.15 59.69,33.27
  Top 0.406: 54.61,33.27 52.07,33.27 50.74,33.27 50.71,33.25 C18.1 49.53,32 48.13,30.61 37.97,30.61 37.85,30.48 24.83,30.48 23.94,29.59 12.13,29.59 12.06,29.53 12,29.46 11.49,28.96 R38.2 | 54.61,33.27 57.15,33.27 | 57.15,33.27 58.42,33.27 59.69,33.27 | DZ4.1 54.67,33.22 54.61,33.27 | DZ5.2 56.97,33.46 57.15,33.27
N$56  (via drill 0.6)
  Top 0.305: SJ5.2 4.57,32 5.08,31.5 4.57,30.99 SJ6.1
  Top 0.406: Q12.2 43.49,18.98 43.81,19.3 44.34,19.3 LED6.C U$10.P$2 | U$11.6 5.08,31.5 R43.1 7.09,30.82 7.43,30.48 7.68,30.23 11.43,30.23 11.68,30.48 23.43,30.48 24.57,31.62 44.07,31.62 v44.2,31.75
  Bottom 0.406: v44.2,31.75 44.2,22.86 U$10.P$2
N$58  (via drill 0.6)
  Top 0.203: U$5.15 64.3,33.3 62.93,34.67 62.93,36.77 62.67,37.02 v61.34,37.02
  Top 0.254: R41.2 50.16,13.59 50.55,13.97 v50.55,20.32
  Bottom 0.254: v61.34,37.02 55.12,37.02 54.36,36.26 50.99,36.26 50.16,35.43 50.16,22.04 50.55,21.65 v50.55,20.32 | v50.55,20.32 50.55,20.19 v50.55,20.32
N$59
  Top 0.305: Q13.1 47.31,13.82 R41.1
N$60  (via drill 0.6)
  Top 0.305: R25.2 37.74,40.81 38.23,40.32 45.47,40.32 47.18,42.04 Q9.1 | Q14.3 52.45,44.77 v52.51,44.77 | U$12.P$6 63.69,44.07 v64.01,44.39
  Top 0.61: 48.96,46.04 Q9.3 48.96,46.04 | 48.96,46.04 Q14.2 | Q9.2 49.02,44.77 | 49.02,44.77 Q14.3 | Q9.1 47.75,43.5 49.02,44.77 | 48.96,46.04 49.4,46.04 Q14.1 | 49.02,44.77 49.02,45.97 48.96,46.04
  Bottom 0.305: v52.51,44.77 63.56,44.77 v64.01,44.39
N$61
  Top 0.406: R42.1 46.26,17.92 LED6.A
N$62
  Top 0.203: U$5.16 64.1,32.8 62.42,34.48 62.42,35.56 62.17,35.81 62.1,35.88 60.26,35.88 60.07,35.69 59.82,35.69
  Top 0.305: SJ2.1 58.29,35.94 58.42,35.81 | SJ3.2 59.82,35.69 59.69,35.81
  Top 0.406: 54.61,35.81 52.07,35.81 50.81,35.81 50.71,35.71 C19.1 49.59,34.54 48.07,33.02 43.37,33.02 43.05,32.7 24.07,32.7 22.92,31.56 10.99,31.56 10.92,31.5 R43.2 | 54.61,35.81 57.15,35.81 | 57.15,35.81 58.42,35.81 59.69,35.81 | DZ5.1 54.67,35.76 54.61,35.81 | DZ6.2 56.97,36 57.15,35.81
N$63  (via drill 0.6)
  Top 0.203: R7.1 57.53,41.47 v57.21,41.78
  Top 0.305: SJ5.1 4.57,33.53 5.08,34.04 | v57.21,41.78 56.45,42.55 51.31,42.55 50.1,42.55 48.9,42.55 47.05,40.7 47.05,39.81 47.37,39.5 v48.9,39.5 | v71.44,42.48 71.69,42.74 71.69,45.15 R8.1
  Top 0.406: U$11.7 5.08,34.04 R44.1 7.09,33.36 7.43,33.02 7.68,32.77 22.42,32.77 23.94,34.29 41.78,34.29 46.42,34.29 48.01,35.88 v49.28,35.88 | v49.53,21.21 49.53,15.45 Q13.2
  Bottom 0.203: v57.21,41.78 57.21,41.85 58.04,42.67 58.17,42.8 65.53,42.8 65.72,42.99 70.93,42.99 v71.44,42.48
  Bottom 0.305: v48.9,39.5 48.9,37.47 48.9,36.26 v49.28,35.88
  Bottom 0.406: v49.28,35.88 49.28,21.46 v49.53,21.21
N$64
  Top 0.203: U$5.14 64.37,33.8 63.37,34.8 63.37,37.59 62.61,38.35 62.23,38.35 60.33,38.35 60.2,38.23 59.82,38.23
  Top 0.305: SJ1.1 58.29,38.48 58.42,38.35 | SJ2.2 59.82,38.23 59.69,38.35
  Top 0.406: 54.61,38.35 52.07,38.35 50.74,38.35 50.71,38.33 C20.1 47.12,37.08 45.72,35.69 23.56,35.69 21.91,34.04 R44.2 | 54.61,38.35 58.42,38.35 59.69,38.35 | DZ6.1 54.67,38.3 54.61,38.35
N$67  (via drill 0.6)
  Top 0.305: Q14.4 53.47,43.5 v53.53,43.56 | U$12.P$5 62.74,43.88 62.17,44.45 60.45,44.45 59.75,43.75 v59.69,43.75
  Bottom 0.305: v53.53,43.56 59.56,43.56 59.69,43.69 v59.69,43.75
N$601  (via drill 0.6)
  Top 0.406: v46.35,21.21 R42.2 46.57,19.3 46.99,19.3 48.26,18.03 Q13.3
  Bottom 0.406: U$10.P$1 46.35,39.5 v46.35,21.21
PWR  (via drill 0.6)
  Top 0.203: v82.93,44.2 82.93,43.69 82.93,42.55 83.63,41.85 v86.17,41.85 | U$6.27 72.75,11.2
  Top 0.254: J1.D6 49.34,2.1 50.67,0.76 50.93,0.51 77.22,0.51 | 77.22,0.51 85.66,0.51 86.61,0.51 88.46,2.35 88.46,8.89 87.88,9.46 | 77.22,0.51 77.22,4.06 77.66,4.51 78.04,4.89 78.04,8 75.95,10.1 73.85,10.1 72.81,11.13 72.81,11.2
  Top 0.305: v87,24.96 87.12,24.96 87.69,24.38 87.88,24.19 87.88,12.45 87.88,9.46 | 72.75,11.2 72.81,11.2 | Q2.1 75.64,46.52 R10.2 74.68,45.53 v74.87,45.34 | v82.93,44.2 82.93,43.69
  Bottom 0.305: v86.17,41.85 86.61,41.85 87.57,40.89 87.57,25.53 v87,24.96 | v74.87,45.34 75.25,45.72 81.79,45.72 82.93,44.58 v82.93,44.2
RESET  (via drill 0.6)
  Top 0.203: U$6.13 61.9,13.08 61.02,13.08 60.77,13.08 60.52,13.34 60.01,13.34 59.12,13.34 v58.61,13.84
  Top 0.254: 57.63,5.4 R28.1
  Top 0.406: JP1.5 57.63,5.4
  Bottom 0.305: JP1.5 55.56,6.16 54.23,7.49 54.23,8.76 55.24,9.78 55.24,10.92 57.98,13.65 58.42,13.65 v58.61,13.84
SCK  (via drill 0.6)
  Top 0.203: U$5.41 69.47,38.8 v67.5,36.83 | U$6.9 64.55,17.14 v64.58,17.14
  Top 0.406: JP1.3 53.53,5.4 54.29,6.16 54.29,6.6 54.29,9.14 54.29,10.16 v54.36,10.22
  Bottom 0.203: v67.5,36.83 65.53,36.83 64.26,35.56 64.26,17.4 64.52,17.14 v64.58,17.14 60.77,17.14 54.36,10.73 v54.36,10.22
  Bottom 0.254: J1.D13 67.12,1.33 66.67,0.89 54.86,0.89 53.78,1.97 53.78,2.22 53.78,4.64 JP1.3
SCL  (via drill 0.6)
  Top 0.203: U$6.18 66.74,12.27 v66.74,12.7
  Top 0.254: U$13.P$8 84.45,23.24 83.44,24.26 R15.1
  Top 0.305: v83.12,13.91 83.12,16.51 85.03,18.41 85.79,18.41 86.61,19.24 86.61,21.08 U$13.P$8
  Bottom 0.203: v66.74,12.7 76.33,22.29 U$13.P$8
  Bottom 0.305: J1.SCL 78.55,3.11 79.95,4.51 79.95,10.73 v83.12,13.91
SDA  (via drill 0.6)
  Top 0.203: U$6.19 67.98,12.38 v68.14,12.38
  Top 0.254: U$13.P$7 83.38,21.78 82.36,22.8 R14.1
  Top 0.305: v81.98,14.54 81.98,17.02 84.64,19.68 85.34,19.68 U$13.P$7
  Bottom 0.203: v68.14,12.38 68.14,13.34 76.52,21.72 83.44,21.72 U$13.P$7
  Bottom 0.305: J1.SDA 76.52,2.6 79.38,5.46 79.38,11.94 v81.98,14.54
SS  (via drill 0.6)
  Top 0.203: U$5.44 68.47,40.3 v67.88,40.89 | v61.53,21.27 61.55,21.27 U$6.8
  Top 0.305: v61.02,6.03 58.42,8.64 57.15,8.64 55.63,10.16 55.63,15.3 v56.07,15.75
  Bottom 0.203: v67.88,40.89 65.15,40.89 62.8,38.54 62.8,22.54 v61.53,21.27
  Bottom 0.305: J1.D10 61.02,2.86 v61.02,6.03 | v56.07,15.75 56.07,15.81 v61.53,21.27
START/E-STOP1  (via drill 0.6)
  Top 0.305: Q10.G 13.02,48.32 14.67,49.97 24.07,49.97 25.15,49.97 25.78,49.34 | v87.63,42.42 88.08,42.86 88.08,48.26 86.36,49.97 72.64,49.97 70.93,49.97 70.48,49.53 25.97,49.53 25.78,49.34 | R26.1 25.21,48.24 25.21,48.77 25.78,49.34
  Bottom 0.203: v87.63,42.42 87.76,42.42
  Bottom 0.305: 87.76,42.42 88.08,42.1 88.08,13.27 86.93,12.13 U$13.P$4
UGND  (via drill 0.6)
  Top 0.203: 10.35,6.48 11.24,5.59 11.24,5.08 11.68,4.64 L1.2 | U$6.5 65.68,20.55 64.71,21.53 64.71,24.64 64.26,25.08 63.59,25.08 C15.1
  Top 0.254: 10.35,6.48 10.41,6.48 v10.6,6.67 | v18.48,9.21 19.88,10.6 42.93,10.6 43.18,10.35 v43.18,10.22 | v57.34,22.16 58.23,22.16 60.2,24.13 61.15,24.13 62.17,25.15 63.52,25.15 C15.1
  Top 0.305: R31.1 64.94,26.48 C15.1
  Top 0.406: X1.5 9.27,6.48 10.35,6.48
  Bottom 0.254: v10.6,6.67 13.14,9.21 v18.48,9.21 | v43.18,10.22 45.91,12.95 49.09,12.95 57.34,21.21 v57.34,22.16
VREG  (via drill 0.6)
  Top 0.203: R11.2 C4.1 v77.53,28.45 76.39,28.45 75.63,29.21 75.63,32.38 74.21,33.8 U$5.31 | TOS.1 v86.49,27.88 | v86.49,27.88 87.12,27.88 v86.49,27.88
  Top 0.254: A3.1 87.19,40.83 87.69,40.32 87.69,38.04 87.25,37.59 | 87.25,37.59 A2.1 87.25,37.59 | 87.25,37.59 87.69,37.15 87.69,34.73 87.31,34.35 A1.1 87.38,34.35 87.69,34.04 87.69,31.56 87.25,31.11 A0.1 87.31,31.11 87.69,30.73 87.69,28.45 87.12,27.88 v86.49,27.88 TOS.1
  Bottom 0.203: v86.49,27.88 85.92,28.45 v77.53,28.45
VTEMP1  (via drill 0.6)
  Top 0.203: C7.2 v78.11,25.65 75.31,25.65 74.61,26.35 74.61,32 74.31,32.3 U$5.28 | 82.23,27.43 v82.42,27.24 81.85,27.81 81.85,29.59 81.79,29.65 81.6,29.84 R11.1
  Top 0.305: v82.42,27.24 83.31,26.35 83.31,25.4 84.26,24.45 85.92,24.45 87.25,23.11 87.25,18.54 85.92,17.21 U$13.P$6
  Bottom 0.203: v82.42,27.24 79.69,27.24 v78.11,25.65

### Text on the board
tPlace: 1 | 0 | 1 | 0 | 1 | 0 | 1 | 0 | 1 | 0 | SCL | SDA | TEMP | GND | STRT/ESTP | ESTOP2 | GND | GND